# EAGLE design MotorDriver-rev1 (EAGLE 7.2.0)
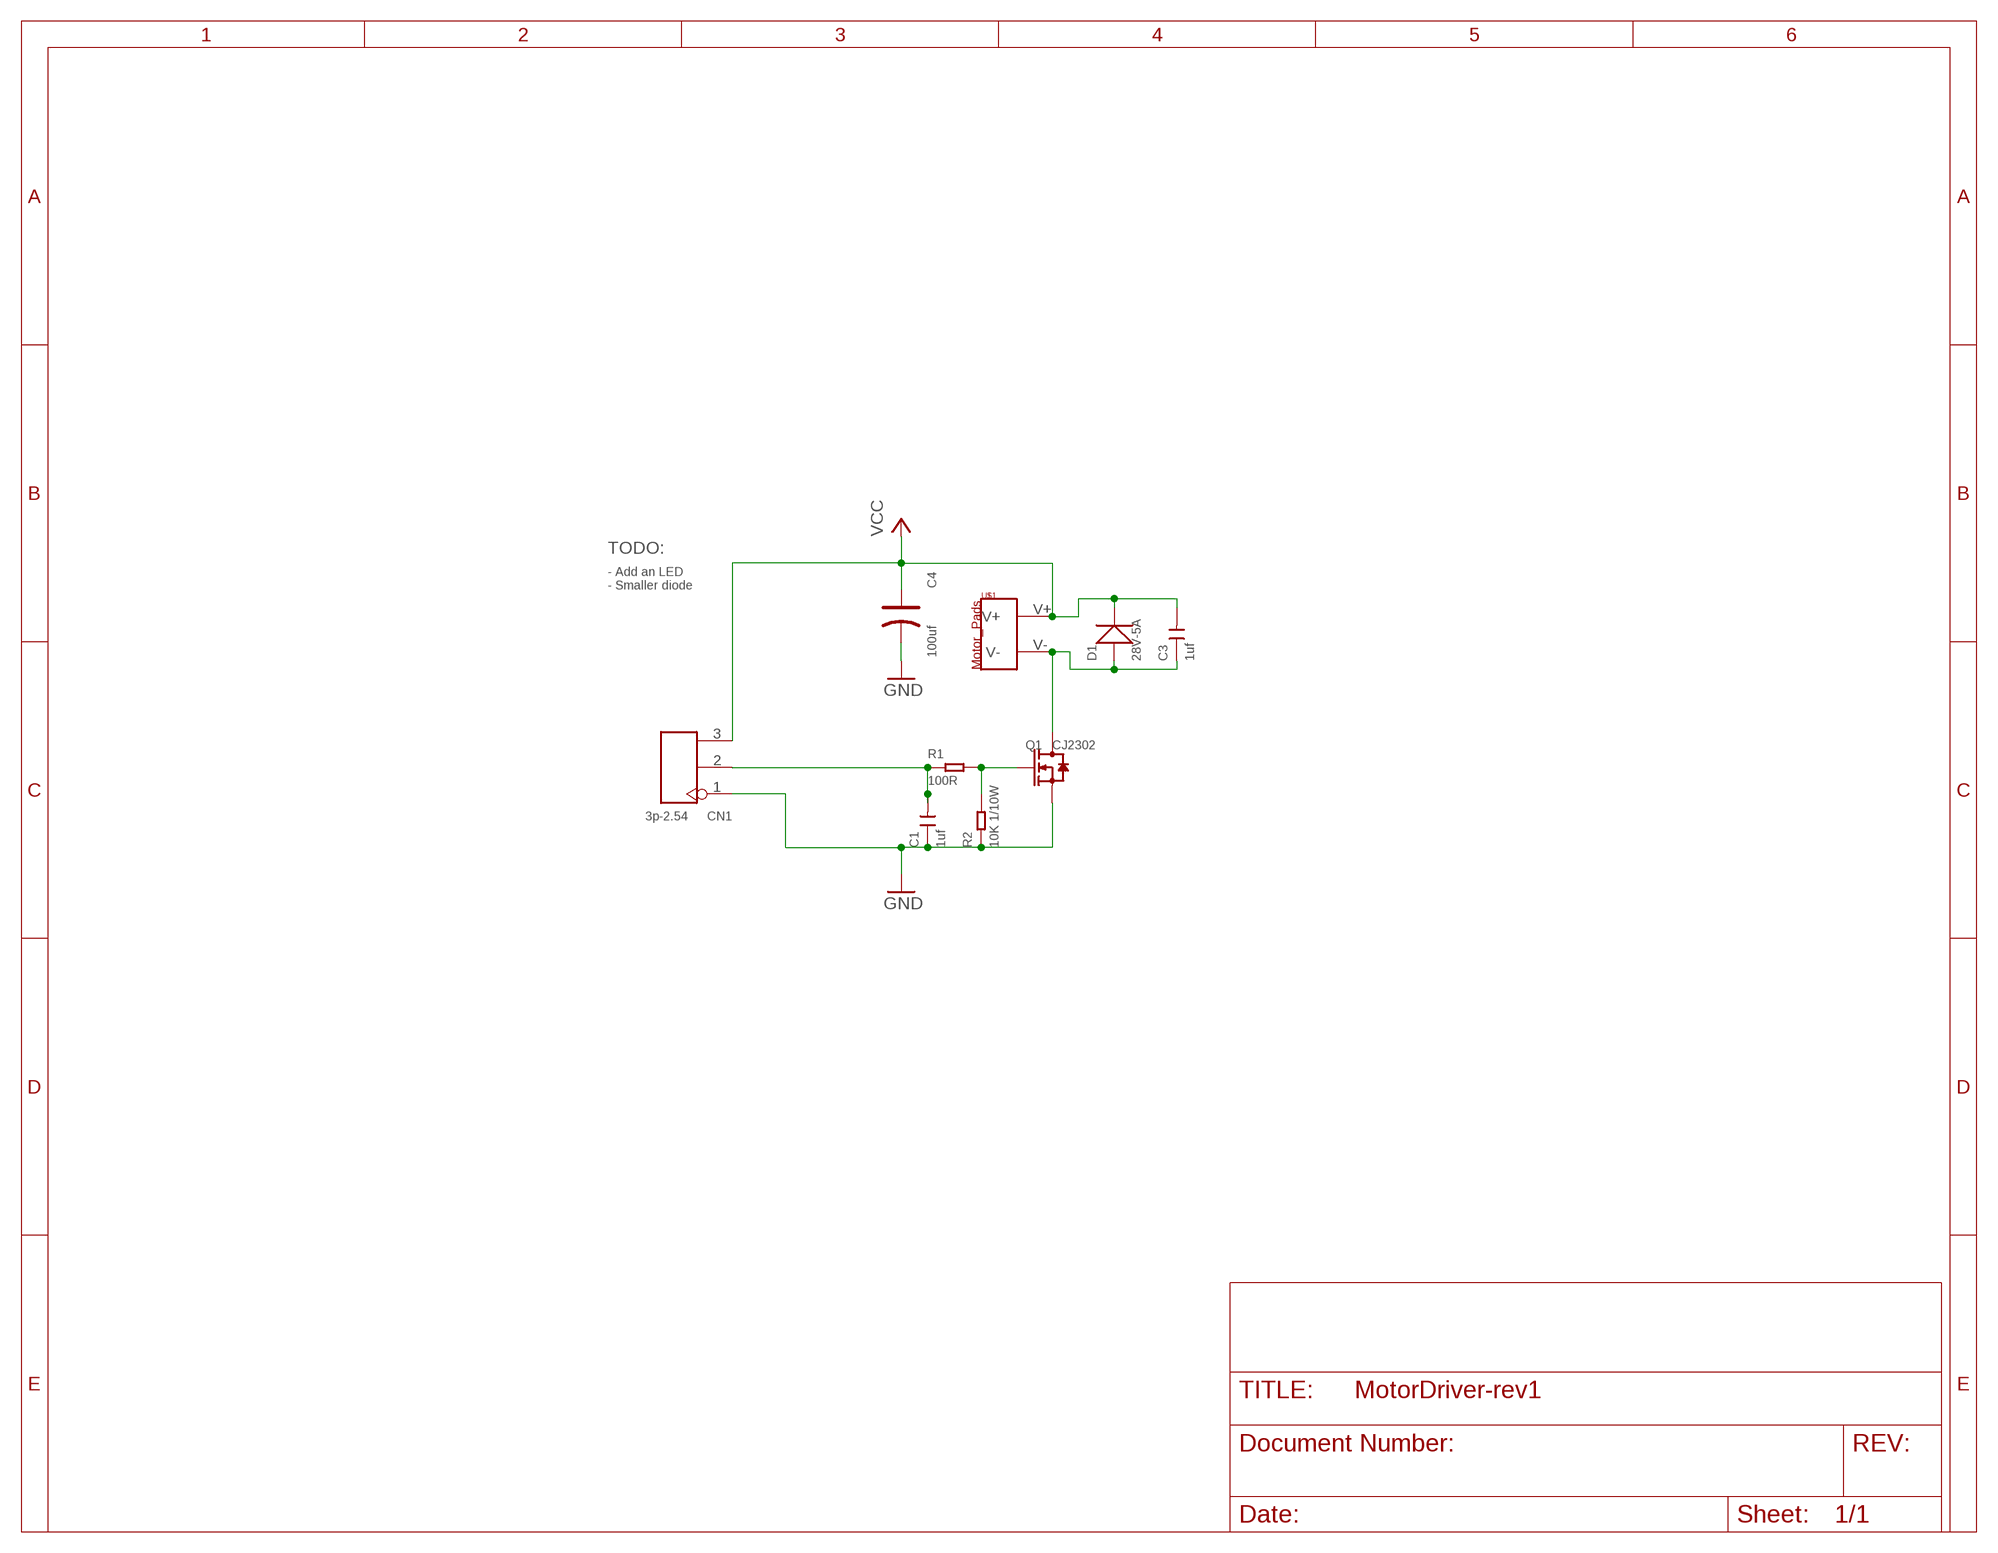
[diagram p0: schematic, sheet 1]

## Parts
C1  1uf  CERAMIC-1UF-10V-10%-X5R(0402)  [C0402]
C3  1uf  CERAMIC-1UF-25V-10%-X7R(0603)  [C0603]
C4  100uf  TANTALUM-SMD-100UF-10V(AVX-B)  [AVX-B]
CN1  3p-2.54  DIP-BLACK-MALE-HEADER-VERT(3P-2.54)  [H3-2.54]
D1  28V-5A  SMD-DIODE-SCHOTTKY-28V-5A(DO-214AA)  [DO-214AA]
Q1  CJ2302  SMD-MOSFET-N-CH-20V-2.1A-CJ2302(SOT-23)  [SOT-23]
R1  100R  SMD-RES-100R-5%-1/10W(0603)  [R0603]
R2  10K 1/10W  SMD-RES-10K-5%-1/10W(0603)  [R0603]
U$1  MOTOR_PADS  [MOTOR_PADS]

## Nets
GND [HighAmps]: C1.1 C4.- CN1.1 Q1.2(S) R2.1
N$3: C1.2 CN1.2 R1.1
N$4: Q1.1(G) R1.2 R2.2
N$6 [HighAmps]: C3.1 D1.+ Q1.3(D) U$1.V-
VCC [HighAmps]: C3.2 C4.+ CN1.3 D1.- U$1.V+

## Notes on the sheet
- TODO:
- - Add an LED
  - Smaller diode

## Library data of the parts
C1 = Seeed-Capacitor-2016:CERAMIC-1UF-10V-10%-X5R(0402): 302010040; MPN: CC0402KRX5R6BB105
C3 = Seeed-Capacitor-2016:CERAMIC-1UF-25V-10%-X7R(0603): 302010139; MPN: CC0603KRX7R8BB105
C4 = Seeed-Capacitor-2016:TANTALUM-SMD-100UF-10V(AVX-B): 302020015; MPN: TAJB107M010#NJ
CN1 = Seeed-Connector -2016:DIP-BLACK-MALE-HEADER-VERT(3P-2.54): 320020079
D1 = Seeed-Diode-2016:SMD-DIODE-SCHOTTKY-28V-5A(DO-214AA): 304020021; MPN: SS54B
Q1 = Seeed-Transistor-2016:SMD-MOSFET-N-CH-20V-2.1A-CJ2302(SOT-23): 305030015; MPN: CJ2302
R1 = Seeed-Resistor-2016:SMD-RES-100R-5%-1/10W(0603): 301010090; MPN: RC0603JR-07100RL
R2 = Seeed-Resistor-2016:SMD-RES-10K-5%-1/10W(0603): 301010293; MPN: RC0603JR-0710KL
U$1 = Andranik-Lab4:MOTOR_PADS

## Net classes
1 HighAmps: width 0.762 mm

## Board
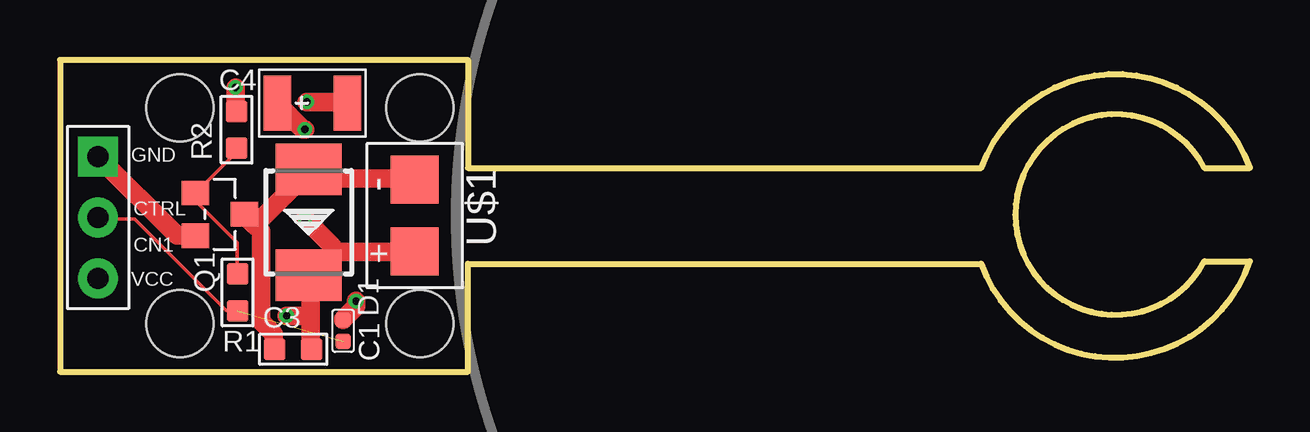
[diagram p1: board, top side]
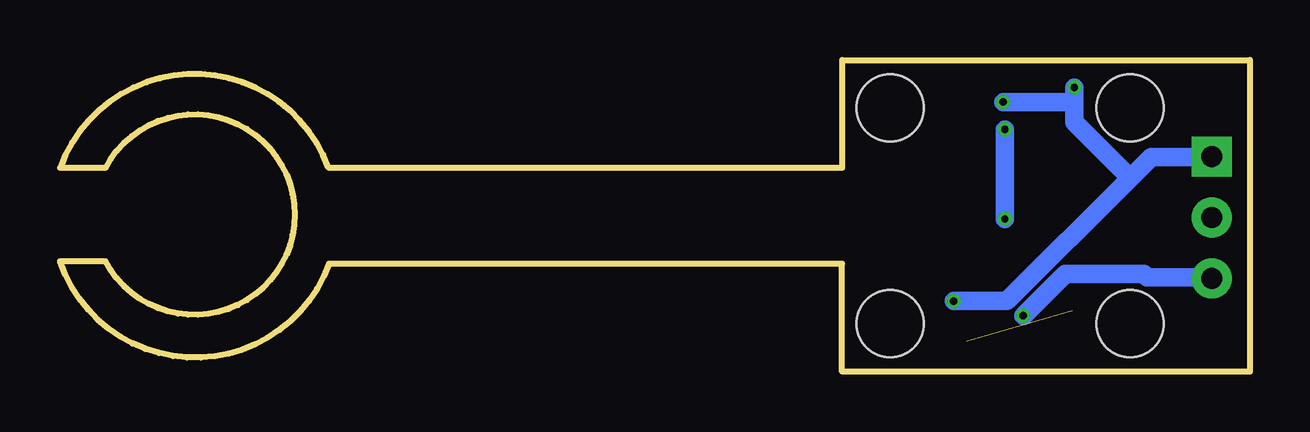
[diagram p2: board, bottom side, seen from below]

Size 49.6 x 13 mm. Coordinates in mm from the lower left corner, seen from the top.
Outline: 38.4,4.5 17,4.5 17,0 0,0 0,13 17,13 17,8.5 38.4,8.5 arc-140 49.6,8.5 47.7,8.5 arc304 47.7,4.6
Outline: 47.7,4.59 49.58,4.6
Outline: 38.38,4.51 arc141 49.6,4.6
Copper layers (1*16): Top 0.035mm / dielectric 1.5mm / Bottom 0.035mm
Design rules "SeeedStudio_2layer_DRU_no_angle_20140221": minimum track width 6mil, minimum drill 12mil, track to track 6mil, track to pad 6mil, pad to pad 6mil, via to via 6mil, smd to smd 0mil, copper to edge 10mil, drill to drill 10mil, minimum pad ring 10mil, minimum via ring 6mil, stop-mask expansion 2mil, vias tented up to drill 100mil, thermal gap 10mil
Holes 2.8 mm at 15,11 15,2 5,2 5,11

### Footprints (pad centres in the part's own frame; a part is rotated, then mirrored left to right if it is on the bottom)
C0402 = smd 0.635 x 0.635: 1 0,0.445; 2 0,-0.445
C0603 = smd 0.889 x 0.889: 1 0,0.762; 2 0,-0.762
AVX-B = smd 1.143 x 2.286: + -1.46,0; - 1.46,0
H3-2.54 = drill 0.889 pad 1.651 square: 1 0,2.54 | drill 0.889 pad 1.651: 2 0,0; 3 0,-2.54
DO-214AA = smd 2.159 x 2.743: + -2.21,0; - 2.21,0
SOT-23 = smd 1.016 x 1.143: 1 -0.889,-1.016; 2 0.889,-1.016; 3 0,1.016
R0603 = smd 0.889 x 0.889: 1 0,0.762; 2 0,-0.762
MOTOR_PADS = smd 2 x 2: V+ -1,0; V- 2,0

### Placement (x,y rotation side)
C1  11.8,1.7 0 top
C3  9.72,0.93 90 top
C4  10.53,11.21 0 top
CN1  1.59,6.43 0 top
D1  10.37,6.23 270 top
Q1  6.67,6.56 270 top
R1  7.4,3.3 180 top
R2  7.36,10.09 0 top
U$1  14.79,6.01 90 top

### Tracks (layer width: path | path; a pad name or v marks a point on that pad's centre or on a via)
GND  (via drill 0.3)
  Top 0.762: v12.34,2.94 12.34,2.71 11.81,2.18 C1.1 | v7.32,11.85 7.32,10.86 R2.1 | Q1.2 5.64,5.68 4.88,5.68 1.6,8.96 CN1.1 | v10.29,11.24 11.96,11.24 C4.-
  Bottom 0.762: v12.34,2.94 10.13,2.94 4.99,8.08 | 4.99,8.08 4.12,8.96 1.6,8.96 CN1.1 | 7.32,11.24 7.32,10.41 4.99,8.08 | 7.32,11.24 v7.32,11.85 | 7.32,11.24 v10.29,11.24
N$3  (1 unrouted)
  Top 0.152: R1.1 7.39,2.56 6.93,2.56 3.12,6.37 1.6,6.37 CN1.2
N$4
  Top 0.152: R2.2 7.32,9.26 7.32,9.11 5.71,7.51 Q1.1 5.71,7.43 5.71,7.05 7.39,5.38 7.39,4.08 R1.2
N$6
  Top 0.762: 8.12,6.1 7.7,6.52 Q1.3 | 8.12,6.1 8.38,5.83 8.38,2.1 8.91,1.57 8.91,0.96 C3.1 | U$1.V- 14.78,8.04 10.82,8.04 10.44,8.43 D1.+ 10.13,8.12 8.12,6.1
VCC  (via drill 0.3)
  Top 0.762: 10.44,2.33 10.44,4 D1.- 10.74,4.23 11.51,5 | 10.44,2.33 10.44,0.96 C3.2 | 11.51,5 14.78,5 U$1.V+ | v10.21,10.1 10.13,10.1 9.07,11.17 C4.+ | v10.21,6.37 11.28,5.3 11.51,5 | 10.44,2.33 v9.45,2.33
  Bottom 0.762: v10.21,6.37 v10.21,10.1 | v9.45,2.33 7.7,4.08 4.42,4.08 4.27,3.93 1.6,3.93 CN1.3

### Text on the board
tPlace: GND | CTRL | VCC